# EAGLE design Adafruit ADS7830 Breakout PCB (EAGLE 9.6.2)
COMPANY: ADAFRUIT INDUSTRIES; DRAWN: KTOWN; REV: A
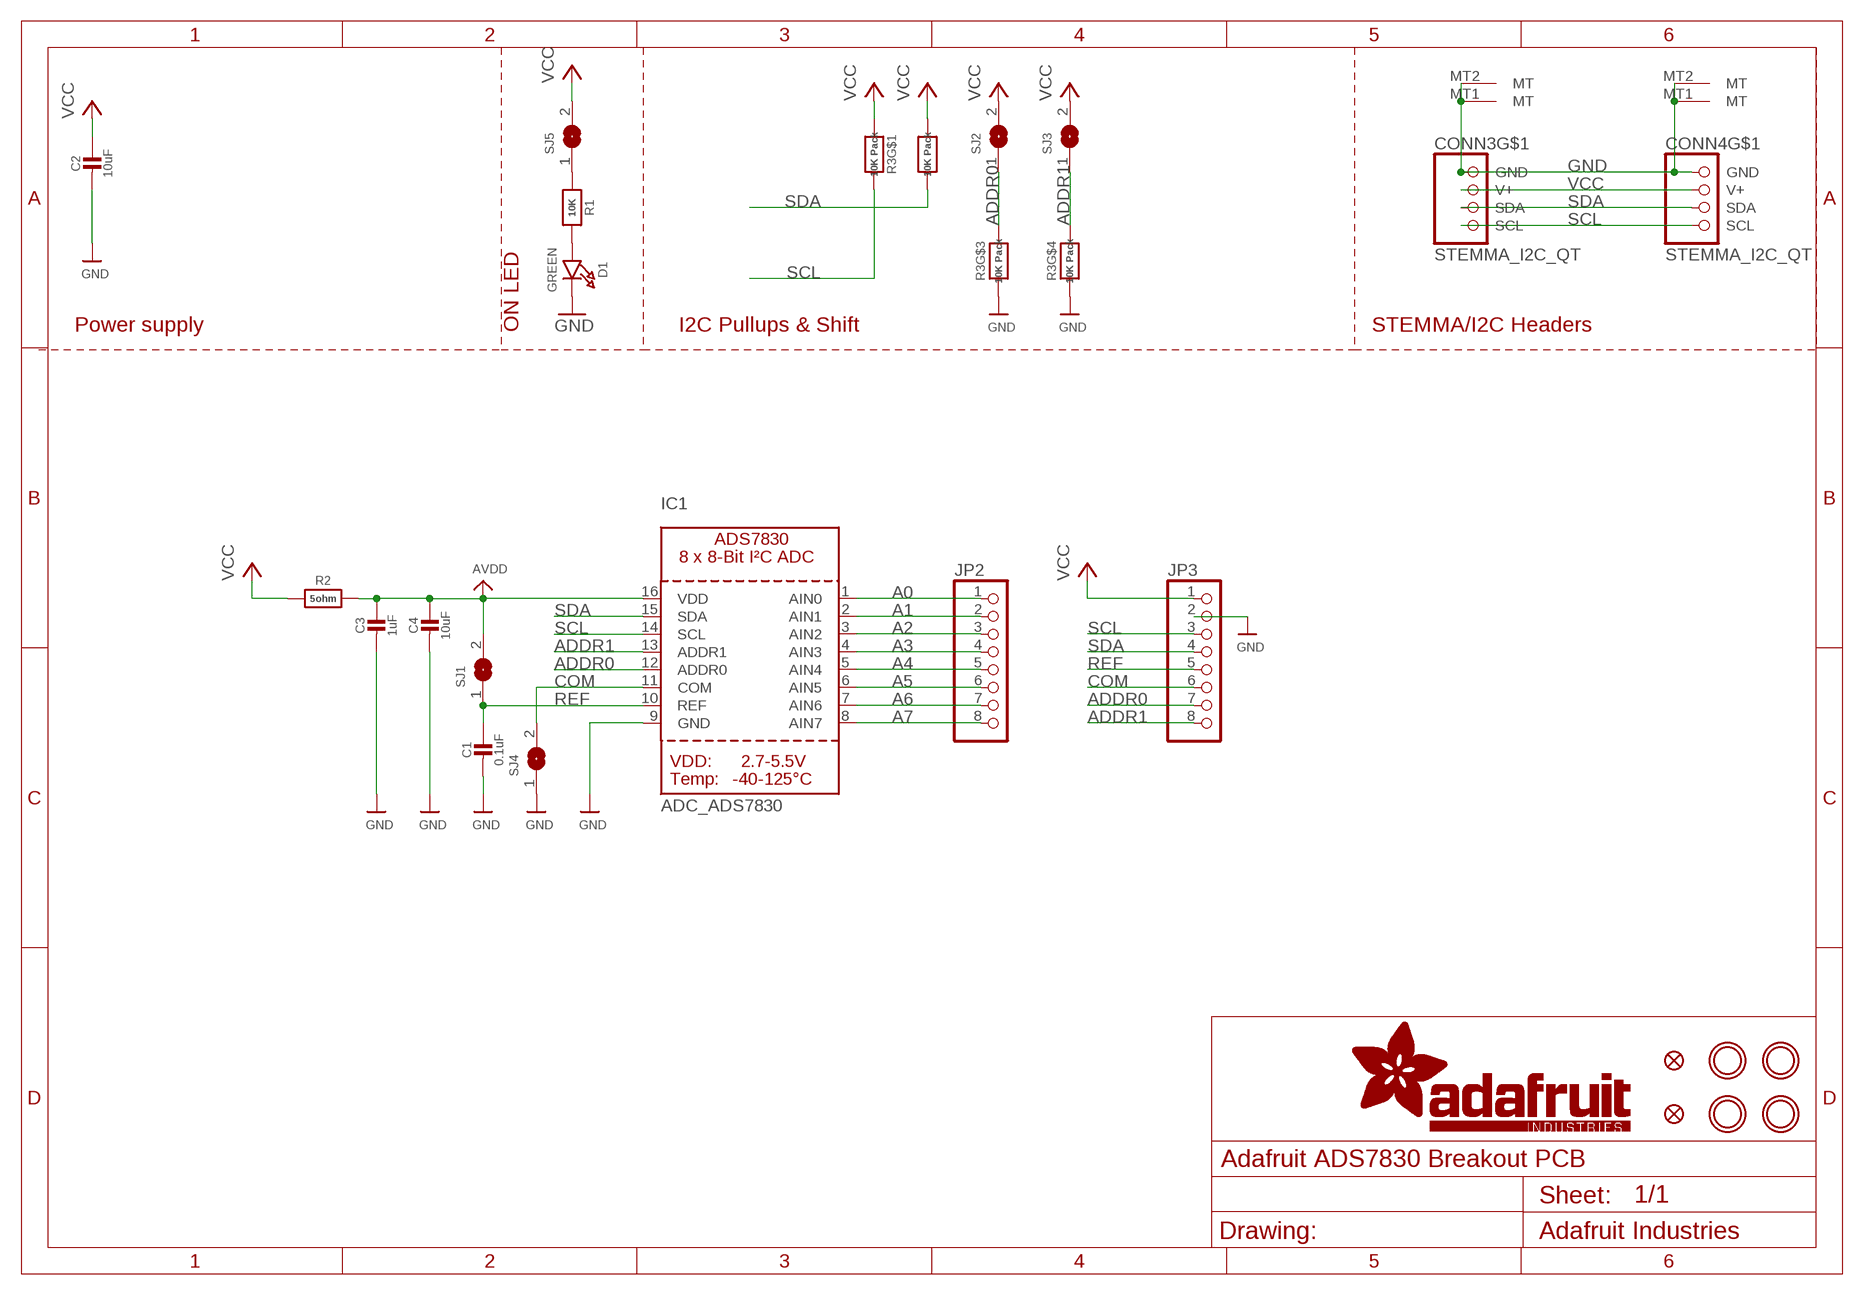
[diagram p0: schematic, sheet 1]

## Parts
C1  0.1uF  CAP_CERAMIC0603_NO  [0603-NO]
C2  10uF  CAP_CERAMIC0805-NOOUTLINE  [0805-NO]
C3  1uF  CAP_CERAMIC0603_NO  [0603-NO]
C4  10uF  CAP_CERAMIC0805-NOOUTLINE  [0805-NO]
CONN3  STEMMA_I2C_QT  [JST_SH4]
CONN4  STEMMA_I2C_QT  [JST_SH4]
D1  GREEN  LED0603_NOOUTLINE  [CHIPLED_0603_NOOUTLINE]
FID3  FIDUCIAL_1MM  [FIDUCIAL_1MM]
FID4  FIDUCIAL_1MM  [FIDUCIAL_1MM]
IC1  ADC_ADS7830  [TSSOP16]
JP2  HEADER-1X870MIL  [1X08_ROUND_70]
JP3  HEADER-1X870MIL  [1X08_ROUND_70]
R1  10K  RESISTOR_0603_NOOUT  [0603-NO]
R2  5ohm  RESISTOR_0603_NOOUT  [0603-NO]
R3  10K Pack  RESISTOR_4PACK  [RESPACK_4X0603]
SJ1  SOLDERJUMPERCLOSED  [SOLDERJUMPER_CLOSEDWIRE]
SJ2  SOLDERJUMPER  [SOLDERJUMPER_ARROW_NOPASTE]
SJ3  SOLDERJUMPER  [SOLDERJUMPER_ARROW_NOPASTE]
SJ4  SOLDERJUMPERCLOSED  [SOLDERJUMPER_CLOSEDWIRE]
SJ5  SOLDERJUMPERCLOSED  [SOLDERJUMPER_CLOSEDWIRE]
U$1  MOUNTINGHOLE2.5  [MOUNTINGHOLE_2.5_PLATED]
U$17  MOUNTINGHOLE2.5  [MOUNTINGHOLE_2.5_PLATED]
U$19  MOUNTINGHOLE2.5  [MOUNTINGHOLE_2.5_PLATED]
U$21  MOUNTINGHOLE2.5  [MOUNTINGHOLE_2.5_PLATED]

## Nets
A0: IC1.1(AIN0) JP2.1
A1: IC1.2(AIN1) JP2.2
A2: IC1.3(AIN2) JP2.3
A3: IC1.4(AIN3) JP2.4
A4: IC1.5(AIN4) JP2.5
A5: IC1.6(AIN5) JP2.6
A6: IC1.7(AIN6) JP2.7
A7: IC1.8(AIN7) JP2.8
ADDR0: IC1.12(ADDR0) JP3.7 R3.6 SJ2.1
ADDR1: IC1.13(ADDR1) JP3.8 R3.5 SJ3.1
AVDD [highpower]: C3.1 C4.1 IC1.16(VDD) R2.2 SJ1.2
COM: IC1.11(COM) JP3.6 SJ4.2
GND [highpower]: C1.2 C2.2 C3.2 C4.2 CONN3.1(GND) CONN3.MT1(MT) CONN3.MT2(MT) CONN4.1(GND) CONN4.MT1(MT) CONN4.MT2(MT) D1.C IC1.9(GND) JP3.2 R3.3 R3.4 SJ4.1
N$1: D1.A R1.2
N$2 [highpower]: R1.1 SJ5.1
REF: C1.1 IC1.10(REF) JP3.5 SJ1.1
SCL: CONN3.4(SCL) CONN4.4(SCL) IC1.14(SCL) JP3.3 R3.8
SDA: CONN3.3(SDA) CONN4.3(SDA) IC1.15(SDA) JP3.4 R3.7
VCC [highpower]: C2.1 CONN3.2(V+) CONN4.2(V+) JP3.1 R2.1 R3.1 R3.2 SJ2.2 SJ3.2 SJ5.2

## Notes on the sheet
- Power supply | ON LED | I2C Pullups & Shift | STEMMA/I2C Headers

## Library data of the parts
C1-C4 = microbuilder:CAP_CERAMIC: Ceramic Capacitors For new designs, use the packages preceded by an '_' character since they are more reliable: The following footprints should be used on most boards: _0402 - Standard footprint for regular board layouts _0603 - Standard footprint for regular board layouts _0805 - Standard footprint for regular board layouts _1206 - Standard footprint for regular board layouts For extremely tight-pitch boards where space is at a premium, the following 'micro-pitch' footprints can be used (smaller pads, no silkscreen outline, etc.): _0402MP - Micro-pitch footprint for very dense/compact boards _0603MP - Micro-pitch footprint for very dense/compact boards _0805MP - Micro-pitch footprint for very dense/compact boards _1206MP - Micro-pitch footprint for very dense/compact boards
CONN3 CONN4 = adafruit_electromech:STEMMA_I2C; LCSC: C2845363
D1 = microbuilder:LED: LED 0603 - 0603 Surface Mount Package 2mA: Green LED - Low Power (3.9mcd, 2ma, 1.7Vf) - Digikey: 475-2709-2-ND Orange LED - Low Power (9.8mcd, 2ma, 1.8Vf) - Digikey: 475-1194-2-ND Red LED - Low Power (5mcd, 2ma, 1.8Vf) - Digikey: 475-1195-2-ND Yellow LED - Low Power (7mcd, 2ma, 1.8Vf) - Digikey: 475-1196-2-ND 5mA: Blue LED - Low Power (17mcd, 5ma, 2.9Vf) - Digikey: LNJ937W8CRACT-ND 0805 - 0805 Surface Mount Package 2mA: Red LED (8.8mcd, 2mA, 1.8Vf, Clear) - Low Power [Digikey: 475-2510-1-ND] Green LED (5mcd, 2mA, 1.8Vf, Clear) - Low Power [Digikey: 475-2730-1-ND] Yellow LED (11.3mcd, 2mA, 1.8Vf, Clear) - Low Power [Digikey: 475-2555-1-ND] 20mA: Red LED (104mcd, 20mA, Diffused) - LS R976 [Digikey: 475-1278-6-ND] Red LED (12mcd, 20mA, 2.0Vf, Clear) - APT2012EC [Digikey: 754-1128-1-ND] Green LED (15mcd, 20mA, 2.2Vf, Clear) - APT2012GC [Digikey: 754-1131-1-ND] Orange LED (160mcd, 20mA, 2.1Vf, Clear) - APT2012SECK [Digikey: 754-1130-1-ND] 1206 - 1206 Surface Mount Package Green LED (26mcd, 20mA, Diffused) - LG N971 [Digikey: 475-1407-6-ND] Red LED (15mcd, 20mA, Diffused) - LH N974 [Digikey: 475-1416-6-ND] Cree - Cree High-Power Surface Mount LEDs XPEBWT-L1-0000-00D50 - White 111lm 350mA 2.9Vf 6200K 110° XTEAWT-00-0000-00000LEE3 - White 114lm 350mA 2.85Vf 5000K 115° Everlight - Everlight 45-21 Series Surface Mount LEDs 45-21/QK2C-B2832AC2CB2/2T - Warm White 2000mcd 20mA 3.25Vf 3050K 120° 45-21/LK2C-B38452C4CB2/2T - Nuetral White 2000mcd 20mA 3.25Vf 4150K 120° 45-21/LK2C-B50634C6CB2/2T - Cold White 2200mcd 20mA 3.25Vf 5650K 120° PLCC2 Reverse Mount LS T77K-J1L2-1-0-2-R18-Z - Red 11.25mcd 2mA 1.8Vf 630nm 120° LO T77K-L1M2-24-Z - Orange 19.6mcd 2mA 1.8Vf 606nm 120° LY T77K-K2M1-26-Z - Yellow 15.7mcd 2mA 1.8Vf 587nm 120°; ROT: 270
FID3 FID4 = microbuilder:FIDUCIAL: Fiducial Alignment Points Various fiducial points for machine vision alignment.; BOM: EXCLUDE
IC1 = adafruit_sensor:ADC_ADS7830
JP2 JP3 = microbuilder:HEADER-1X8: PIN HEADER
R1 R2 = microbuilder:RESISTOR: Resistors For new designs, use the packages preceded by an '_' character since they are more reliable: The following footprints should be used on most boards: _0402 - Standard footprint for regular board layouts _0603 - Standard footprint for regular board layouts _0805 - Standard footprint for regular board layouts _1206 - Standard footprint for regular board layouts For extremely tight-pitch boards where space is at a premium, the following 'micro-pitch' footprints can be used (smaller pads, no silkscreen outline, etc.): _0402MP - Micro-pitch footprint for very dense/compact boards _0603MP - Micro-pitch footprint for very dense/compact boards _0805MP - Micro-pitch footprint for very dense/compact boards _1206MP - Micro-pitch footprint for very dense/compact boards
R3 = microbuilder:RESISTOR_4PACK: Resistor Packs (4 resistors) 4 x 0603 10K 1/16W - Digikey: YC164J-10KCT-ND
SJ1 SJ4 SJ5 = microbuilder:SOLDERJUMPER: SMD Solder JUMPER Solder the two pads together to create a connection, or remove the solder to break it. REFLOW - Use this footprint for solder paste and reflow ovens. WAVE - Use this footprint for hand-soldering (larger pads). CLOSED - Has a trace between the two pads to ensure it is closed by default. The trace needs to be cut to disable the jumper, and can be closed again by creating a solder bridge between the two pads.
SJ2 SJ3 = microbuilder:SOLDERJUMPER: SMD Solder JUMPER Solder the two pads together to create a connection, or remove the solder to break it. REFLOW - Use this footprint for solder paste and reflow ovens. WAVE - Use this footprint for hand-soldering (larger pads). CLOSED - Has a trace between the two pads to ensure it is closed by default. The trace needs to be cut to disable the jumper, and can be closed again by creating a solder bridge between the two pads.; BOM: EXCLUDE
U$1 U$17 U$19 U$21 = adafruit_electromech:MOUNTINGHOLE: Mounting Hole For #2 screws (0.086"/2.18mm width, 0.094"/2.4mm hole) use 2.5mm; BOM: EXCLUDE

## Net classes
1 highpower: width 0.305 mm, drill 0.483 mm
2 lowpower: width 0.254 mm, drill 0.483 mm

## Board
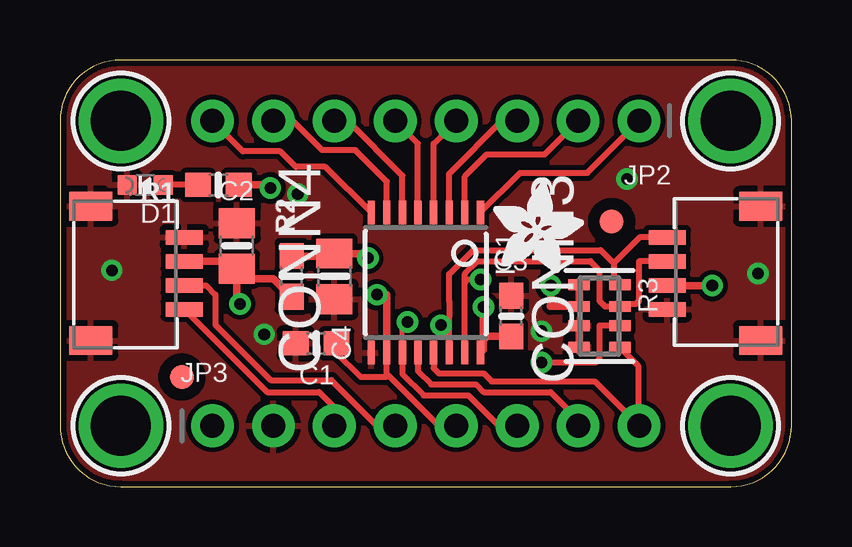
[diagram p1: board, top side]
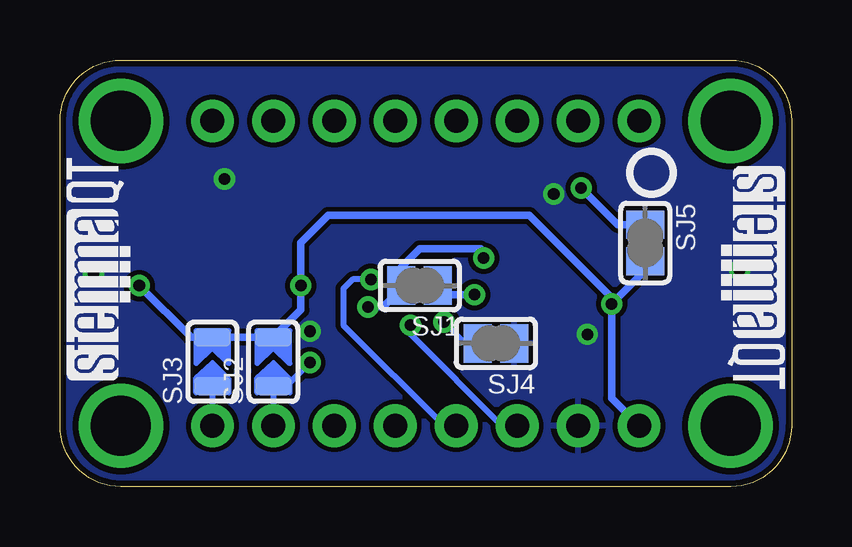
[diagram p2: board, bottom side, seen from below]

Size 30.48 x 17.78 mm. Coordinates in mm from the lower left corner, seen from the top.
Outline: 0,15.24 0,2.54 arc90 2.54,0 27.94,0 arc90 30.48,2.54 30.48,15.24 arc90 27.94,17.78 2.54,17.78 arc90 0,15.24
Copper layers (1*16): Top 0.035mm / dielectric 1.5mm / Bottom 0.035mm
Design rules "adafruit *": minimum track width 8mil, minimum drill 15.5mil, track to track 8mil, track to pad 8mil, pad to pad 8mil, via to via 8mil, smd to smd 8mil, copper to edge 10mil, drill to drill 8mil, minimum pad ring 10mil, minimum via ring 8mil, stop-mask expansion 2mil, vias tented up to drill 20mil, thermal gap 10mil

### Footprints (pad centres in the part's own frame; a part is rotated, then mirrored left to right if it is on the bottom)
0603-NO = smd 1.075 x 1: 1 -0.85,0; 2 0.85,0
0805-NO = smd 1.24 x 1.5: 1 -0.95,0; 2 0.95,0
JST_SH4 = smd 0.6 x 1.55: 1 -1.5,2.006; 2 -0.5,2.006; 3 0.5,2.006; 4 1.5,2.006 | smd 1.2 x 1.8: MT1 -2.8,-1.894; MT2 2.8,-1.894
CHIPLED_0603_NOOUTLINE = smd 0.8 x 0.8: A 0,-0.75; C 0,0.75
FIDUCIAL_1MM = smd 1 x 1: 1 0,0
TSSOP16 = smd 0.305 x 0.991: 1 -2.275,-2.918; 2 -1.625,-2.918; 3 -0.975,-2.918; 4 -0.325,-2.918; 5 0.325,-2.918; 6 0.975,-2.918; 7 1.625,-2.918; 8 2.275,-2.918; 9 2.275,2.918; 10 1.625,2.918; 11 0.975,2.918; 12 0.325,2.918; 13 -0.325,2.918; 14 -0.975,2.918; 15 -1.625,2.918; 16 -2.275,2.918
1X08_ROUND_70 = drill 1 pad 1.778: 1 -8.89,0; 2 -6.35,0; 3 -3.81,0; 4 -1.27,0; 5 1.27,0; 6 3.81,0; 7 6.35,0; 8 8.89,0
RESPACK_4X0603 = smd 0.45 x 0.9: 1 -1.3,-0.85; 2 -0.4,-0.85; 3 0.4,-0.85; 4 1.3,-0.85; 5 1.3,0.85; 6 0.4,0.85; 7 -0.4,0.85; 8 -1.3,0.85
SOLDERJUMPER_CLOSEDWIRE = smd 1.168 x 1.6: 1 -0.762,0; 2 0.762,0 | smd 0.635 x 0.203: WIRE 0,0
SOLDERJUMPER_ARROW_NOPASTE = smd 0.762 x 1.524: 1 -1.016,0; 2 1.016,0
MOUNTINGHOLE_2.5_PLATED = drill 2.5 pad 3.2: P$1 0,0

### Placement (x,y rotation side)
C1  10.67,5.97 180 top
C2  7.37,10.03 90 top
C3  18.8,7.11 90 top
C4  11.43,8.76 270 top
CONN3  27.3,8.89 90 top
CONN4  3.17,8.89 270 top
D1  3.56,12.57 90 top
FID3  5.08,4.57 0 top
FID4  22.99,11.05 0 top
IC1  15.24,8.51 180 top
JP2  15.24,15.24 180 top
JP3  15.24,2.54 0 top
PLABEL0  [PLABEL0]  6.35,0.89 0 top
PLABEL1  [PLABEL1]  16.51,0.89 0 top
PLABEL2  [PLABEL2]  8.89,4.19 0 top
PLABEL3  [PLABEL3]  11.56,0.89 0 top
PLABEL4  [PLABEL4]  14.1,4.19 0 top
PLABEL5  [PLABEL5]  19.18,4.19 0 top
PLABEL6  [PLABEL6]  14.86,13.08 0 top
PLABEL7  [PLABEL7]  0.38,12.45 0 top
PLABEL8  [PLABEL8]  21.72,0.89 0 top
PLABEL9  [PLABEL9]  24.26,4.19 0 top
PLABEL10  [PLABEL10]  6.35,17.02 0 top
PLABEL11  [PLABEL11]  8.89,17.02 0 top
PLABEL12  [PLABEL12]  11.43,17.02 0 top
PLABEL13  [PLABEL13]  13.97,17.02 0 top
PLABEL14  [PLABEL14]  16.51,17.02 0 top
PLABEL15  [PLABEL15]  21.59,17.02 0 top
PLABEL16  [PLABEL16]  24.13,17.02 0 top
PLABEL17  [PLABEL17]  19.05,17.02 0 top
PLABEL18  [PLABEL18]  17.91,12.83 0 bottom
PLABEL19  [PLABEL19]  17.53,10.92 0 bottom
PLABEL20  [PLABEL20]  15.24,0.89 0 bottom
PLABEL21  [PLABEL21]  24.26,8.38 90 bottom
PLABEL22  [PLABEL22]  21.72,8.38 90 bottom
PLABEL23  [PLABEL23]  11.3,8.64 0 bottom
PLABEL24  [PLABEL24]  16.89,5.97 0 bottom
PLABEL25  [PLABEL25]  4.19,10.16 90 bottom
R1  6.6,12.57 180 top
R2  9.65,8.76 90 top
R3  22.48,7.11 270 top
SJ1  15.49,8.38 180 bottom
SJ2  21.59,5.21 90 bottom
SJ3  24.13,5.21 90 bottom
SJ4  12.32,5.97 180 bottom
SJ5  6.1,10.16 270 bottom
U$1  2.54,15.24 0 top
U$17  27.94,15.24 0 top
U$19  2.54,2.54 0 top
U$21  27.94,2.54 0 top
U$22  [ADAFRUIT_3.5MM]  18.03,8.89 0 top
U$25  [PCBFEAT-REV-040]  5.84,13.08 0 bottom
U$30  [STEMMAQT]  27.56,4.45 90 bottom
U$31  [STEMMAQT]  2.92,13.34 270 bottom

### Tracks (layer width: path | path; a pad name or v marks a point on that pad's centre or on a via)
A0
  Top 0.254: IC1.1 19.17,13.08 21.97,13.08 JP2.1
A1
  Top 0.254: IC1.2 16.86,12.93 17.78,13.84 20.19,13.84 JP2.2
A2
  Top 0.254: IC1.3 16.21,13.04 18.41,15.24 JP2.3
A3
  Top 0.254: IC1.4 15.56,14.29 JP2.4
A4
  Top 0.254: IC1.5 14.91,14.29 JP2.5
A5
  Top 0.254: IC1.6 14.27,12.97 11.99,15.24 JP2.6
A6
  Top 0.254: IC1.7 13.62,12.72 12.31,14.02 10.93,14.02 9.71,15.24 JP2.7
A7
  Top 0.254: JP2.8 7.62,13.97 9.19,13.97 9.82,13.33 11.06,13.33 IC1.8
ADDR0  (via drill 0.48)
  Top 0.254: IC1.12 14.91,4.82 15.47,4.27 17.33,4.27 17.66,3.94 20.45,3.94 21.59,2.79 JP3.7 | R3.6 22.48,6.71 22.48,5.33 22.31,5.17 v20.07,5.17
  Bottom 0.254: JP3.7 SJ2.1 21.04,4.19 v20.07,5.17
ADDR1
  Top 0.254: IC1.13 15.56,4.94 15.78,4.72 17.65,4.72 17.98,4.39 22.28,4.39 24.09,2.58 | R3.5 24.09,5.05 24.09,2.58 | 24.09,2.58 JP3.8
  Bottom 0.254: SJ3.1 JP3.8
AVDD  (via drill 0.48)
  Top 0.305: IC1.16 17.64,5.72 17.64,6.1 | 17.64,6.1 17.8,6.26 C3.1 | v17.64,7.49 17.64,6.1 | R2.2 11.33,9.61 C4.1 12.64,9.71 v12.83,9.53
  Bottom 0.305: v17.64,7.49 17,7.49 16.26,8.24 SJ1.2 16.26,9.14 15.49,9.91 12.95,9.91 12.83,9.78 v12.83,9.53
COM  (via drill 0.48)
  Top 0.203: IC1.11 14.27,6.64 v14.48,6.86
  Top 0.254: IC1.11 14.27,4.7 15.15,3.81 17.02,3.81 18.29,2.54 JP3.6
  Bottom 0.203: v14.48,6.86 13.59,5.97 SJ4.2
GND  (via drill 0.48)
  Top 0.305: R3.4 R3.3
  other vias: 8.51,6.35 2.16,9.02 9.91,12.19 23.62,12.83 29.08,8.89 20.07,6.48
  pour Top: 0,17.78 30.48,17.78 30.48,0 0,0
  pour Bottom: 0,17.78 30.48,17.78 30.48,0 0,0
N$1
  Top 0.254: R1.2 D1.A
N$2  (via drill 0.48)
  Top 0.305: R1.1 8.64,12.57 v8.76,12.45
  Bottom 0.305: v8.76,12.45 7.24,10.92 SJ5.1
REF  (via drill 0.48)
  Top 0.254: C1.1 11.52,5.59 12.53,4.57 13.59,4.57 13.62,4.6 13.62,4.7 | 13.62,4.7 IC1.10 | JP3.5 15.77,2.54 13.62,4.7
  Top 0.305: IC1.10 13.62,8 v13.21,8
  Bottom 0.305: SJ1.1 14.35,8 v13.21,8
SCL  (via drill 0.48)
  Top 0.254: CONN4.4 8.63,3.94 10.79,3.94 11.43,3.3 JP3.3 | CONN3.4 24.16,10.39 23.08,9.31 | 23.08,9.31 23.07,9.31 23.07,8.67 R3.8 | IC1.14 16.21,7.07 | 23.08,9.31 22.53,9.86 17.21,9.86 16.21,8.86 16.21,7.75 16.21,7.07 | 16.21,7.07 v15.88,6.73
  Bottom 0.254: v15.88,6.73 15.88,6.35 12.06,2.54 JP3.3
SDA  (via drill 0.48)
  Top 0.254: CONN4.3 6.09,8.39 6.48,8 6.48,6.74 8.77,4.45 11.3,4.45 13.21,2.54 JP3.4 | CONN3.3 24.12,9.39 24.12,7.74 24,7.61 23.43,7.61 R3.7 22.71,7.51 22.64,7.59 22.48,7.75 22.48,9.02 22.1,9.4 17.4,9.4 16.86,8.86 16.86,8.51 | IC1.15 16.86,8.51 | 16.86,8.51 16.99,8.64 v17.53,8.64
  Bottom 0.254: v17.53,8.64 18.29,8.64 18.67,8.26 18.67,6.73 14.48,2.54 JP3.4
VCC  (via drill 0.48)
  Top 0.305: C2.1 7.77,8.68 8.89,8.68 R2.1 | CONN4.2 7.06,9.39 C2.1 | R3.1 R3.2 20.43,7.51 20.45,7.53 v20.45,8.38 | v27.18,8.38 CONN3.2 | C2.1 7.37,7.75 v7.49,7.62
  Bottom 0.305: v27.18,8.38 25.02,6.22 SJ3.2 SJ2.2 20.45,7.37 v20.45,8.38 20.45,10.16 19.3,11.3 10.92,11.3 7.49,7.87 v7.49,7.62 | v7.49,7.62 7.49,3.68 JP3.1 | v7.49,7.62 6.1,9.02 SJ5.2

### Text on the board
Pinguin_tBackup: A7 | A6 | A5 | A4 | A3 | A2 | A1 | A0 | ADS7830 | on | GND | SDA | COM | AD1 | VIN | SCL | REF | AD0
Pinguin_bBackup: ADS7830 | 8 Channel 8-bit ADC | LED | Ext Ref | AD0 | AD1 | Ext Com | VLogic/Vcc: 3-5VDC